# Altium schematic sheet Ad Hoc Radio Node 2005 v4.SCHDOC
size B
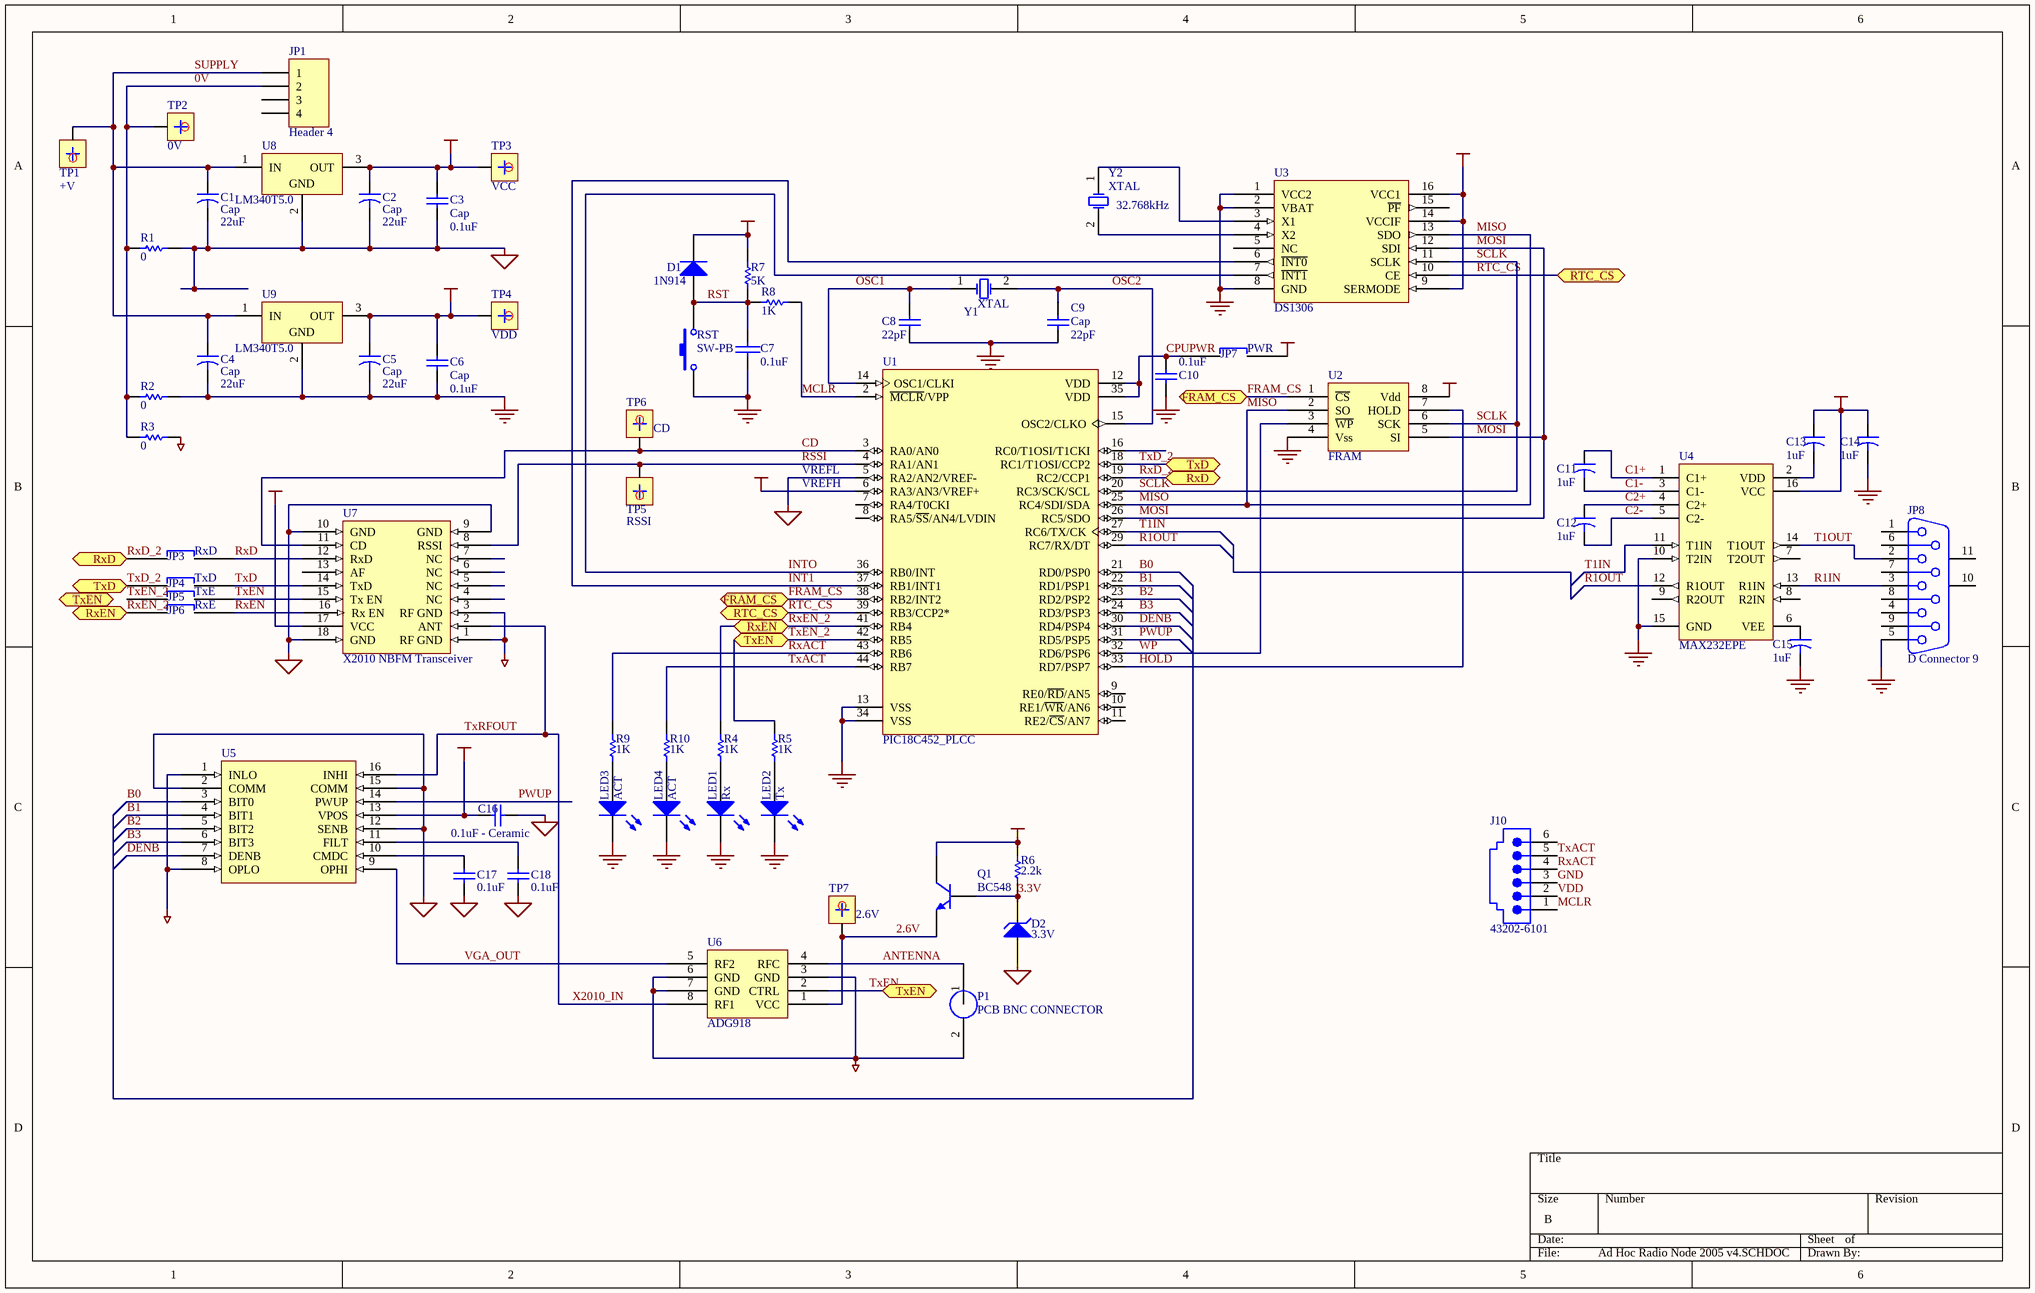
[diagram p0: Ad Hoc Radio Node 2005 v4.SCHDOC]

## Parts
C1  Cap  value 22uF  [0.1 ELECTRO CAP]
C2  Cap  value 22uF  [0.1 ELECTRO CAP]
C3  Cap  value 0.1uF  [0.1 CERAMIC CAP]
C4  Cap  value 22uF  [0.1 ELECTRO CAP]
C5  Cap  value 22uF  [0.1 ELECTRO CAP]
C6  Cap  value 0.1uF  [0.1 CERAMIC CAP]
C7  0.1uF  [0.1 ceramic cap]
C8  value 22pF  [0.1 CERAMIC CAP]  (hidden comment: Cap)
C9  Cap  value 22pF  [0.1 CERAMIC CAP]
C10  value 0.1uF  [0.1 CERAMIC CAP]
C11  value 1uF  [0.1 ELECTRO CAP]  (hidden comment: Cap2)
C12  value 1uF  [0.1 ELECTRO CAP]  (hidden comment: Cap2)
C13  value 1uF  [0.1 ELECTRO CAP]  (hidden comment: Cap2)
C14  value 1uF  [0.1 ELECTRO CAP]  (hidden comment: Cap2)
C15  value 1uF  [0.1 ELECTRO CAP]  (hidden comment: Cap2)
C16  value 0.1uF - Ceramic  [0.1 CERAMIC CAP]
C17  value 0.1uF  [0.1 CERAMIC CAP]
C18  value 0.1uF  [0.1 CERAMIC CAP]
D1  1N914  [diode-0.4/1.8]
D2  value 3.3V  [diode-0.4/1.8]  (hidden comment: D Zener)
J10  43202-6101  [JACK1.27-2H6]
JP1  Header 4  [4 Way Terminal Block]
JP3  RxD  [JUMPER]
JP4  TxD  [JUMPER]
JP5  TxE  [JUMPER]
JP6  RxE  [JUMPER]
JP7  PWR  [JUMPER]
JP8  D Connector 9  [DSUB1.385-2H9]
LED1  Rx  [Std LED]
LED2  Tx  [Std LED]
LED3  ACT  [Std LED]
LED4  ACT  [Std LED]
P1  PCB BNC CONNECTOR  [PCB BNC Connector]
Q1  BC548  [bjt]
R1  value 0  [AXIAL-0.3]
R2  value 0  [AXIAL-0.3]
R3  value 0  [AXIAL-0.3]
R4  value 1K  [AXIAL-0.4/1.8]
R5  value 1K  [AXIAL-0.4/1.8]
R6  value 2.2k  [AXIAL-0.4/1.8]
R7  value 5K  [AXIAL-0.4/1.8]  (hidden comment: Res1)
R8  value 1K  [AXIAL-0.4/1.8]  (hidden comment: Res1)
R9  value 1K  [AXIAL-0.4/1.8]
R10  value 1K  [AXIAL-0.4/1.8]
RST  SW-PB  [RESET SWITCH]
TP1  +V  [TESTPOINT]
TP2  0V  [TESTPOINT]
TP3  VCC  [TESTPOINT]
TP4  VDD  [TESTPOINT]
TP5  RSSI  [TESTPOINT]
TP6  CD  [TESTPOINT]
TP7  2.6V  [TESTPOINT]
U1  PIC18C452_PLCC  [PLCC 44-Way IC Socket]
U2  FRAM  [SOP-8]
U3  DS1306  [DIP-16]
U4  MAX232EPE  [DIP-16]
U5  (no value)  [ad8639 carrier board]
U6  ADG918  [DIP-8]
U7  X2010 NBFM Transceiver  [X2010]
U8  LM340T5.0  [SFM-T3/A4.7V]
U9  LM340T5.0  [SFM-T3/A4.7V]
Y1  XTAL  [XTAL]
Y2  XTAL  value 32.768kHz  [watch crystal]

## Ports
FRAM_CS, RTC_CS, RxD, RxEN, TxD, TxEN

## Nets
GND: C4.2 C5.2 C6.2 C7.2 C8.1 C9.1 C10.2 C14.2 C15.2 J10.3 JP8.5 LED1.2(K) LED2.2(K) LED3.2(K) LED4.2(K) R2.2 RST.1 U1.13(VSS) U1.34(VSS) U2.4(Vss) U3.1(VCC2) U3.2(VBAT) U3.8(GND) U4.10(T2IN) U4.15(GND) U9.2(GND)
RFGND: P1.2 R3.2 U5.1(INLO) U5.8(OPLO) U6.3(GND) U6.6(GND) U6.7(GND) U7.1(RF_GND) U7.3(RF_GND)
SGND: C1.2 C2.2 C3.2 C16.1 C17.2 C18.2 D2.1(A) R1.2 U1.5(RA2/AN2/VREF-) U5.2(COMM) U5.12(SENB) U5.15(COMM) U7.9(GND) U7.10(GND) U7.18(GND) U8.2(GND)
VCC: C2.1 C3.1 C16.2 Q1.1(C) R6.1 TP3.1(TP) U1.6(RA3/AN3/VREF+) U5.13(VPOS) U7.17(VCC) U8.3(OUT)
VDD: C5.1 C6.1 C13.1 C14.1 D1.2(K) J10.2 JP7.2 R7.2 TP4.1(TP) U2.8(Vdd) U3.9(SERMODE) U3.14(VCCIF) U3.16(VCC1) U4.16(VCC) U9.3(OUT)
0V: JP1.2 R1.1 R2.1 R3.1 TP2.1(TP)
2.6V: Q1.3(E) TP7.1(TP) U6.1(VCC)
3.3V: D2.2(K) Q1.2(B) R6.2
ANTENNA: P1.1 U6.4(RFC)
B0: U1.21(RD0/PSP0) U5.3(BIT0)
B1: U1.22(RD1/PSP1) U5.4(BIT1)
B2: U1.23(RD2/PSP2) U5.5(BIT2)
B3: U1.24(RD3/PSP3) U5.6(BIT3)
C1+: C11.1 U4.1(C1+)
C1-: C11.2 U4.3(C1-)
C2+: C12.1 U4.4(C2+)
C2-: C12.2 U4.5(C2-)
CD: TP6.1(TP) U1.3(RA0/AN0) U7.11(CD)
CPUPWR: C10.1 JP7.1 U1.12(VDD) U1.35(VDD)
DENB: U1.30(RD4/PSP4) U5.7(DENB)
FRAM_CS: U1.38(RB2/INT2) U2.1(~{CS}) ; port FRAM_CS
HOLD: U1.33(RD7/PSP7) U2.7(HOLD)
INT1: U1.37(RB1/INT1) U3.6(~{INT0})
INTO: U1.36(RB0/INT) U3.7(~{INT1})
MCLR: J10.1 R8.1 U1.2(~{MCLR}/VPP)
MISO: U1.25(RC4/SDI/SDA) U2.2(SO) U3.13(SDO)
MOSI: U1.26(RC5/SDO) U2.5(SI) U3.12(SDI)
OSC1: C8.2 U1.14(OSC1/CLKI) Y1.1(OSC1)
OSC2: C9.2 U1.15(OSC2/CLKO) Y1.2(OSC2)
PWUP: U1.31(RD5/PSP5) U5.14(PWUP)
R1IN: JP8.3 U4.13(R1IN)
R1OUT: U1.29(RC7/RX/DT) U4.12(R1OUT)
RSSI: TP5.1(TP) U1.4(RA1/AN1) U7.8(RSSI)
RST: C7.1 D1.1(A) R7.1 R8.2 RST.2
RTC_CS: U1.39(RB3/CCP2*) U3.10(CE) ; port RTC_CS
RxACT: J10.4 R9.1 U1.43(RB6)
RxD: JP3.2 U7.12(RxD)
RxD_2: JP3.1 U1.19(RC2/CCP1) ; port RxD
RxEN: JP6.2 U7.16(Rx_EN)
RxEN_2: JP6.1 R4.1 U1.41(RB4) ; port RxEN
SCLK: U1.20(RC3/SCK/SCL) U2.6(SCK) U3.11(SCLK)
SUPPLY: C1.1 C4.1 JP1.1 TP1.1(TP) U8.1(IN) U9.1(IN)
T1IN: U1.27(RC6/TX/CK) U4.11(T1IN)
T1OUT: JP8.2 U4.14(T1OUT)
TxACT: J10.5 R10.1 U1.44(RB7)
TxD: JP4.2 U7.14(TxD)
TxD_2: JP4.1 U1.18(RC1/T1OSI/CCP2) ; port TxD
TxEN: JP5.1 JP5.2 R5.1 U1.42(RB5) U6.2(CTRL) U7.15(Tx_EN) ; port TxEN  [also labelled TxEN_2]
TxRFOUT: U5.16(INHI) U6.8(RF1) U7.2(ANT)  [also labelled X2010_IN]
VGA_OUT: U5.9(OPHI) U6.5(RF2)
WP: U1.32(RD6/PSP6) U2.3(~{WP})
NetC13_2: C13.2 U4.2(VDD)
NetC15_1: C15.1 U4.6(VEE)
NetC17_1: C17.1 U5.10(CMDC)
NetC18_1: C18.1 U5.11(FILT)
NetLED1_1: LED1.1(A) R4.2
NetLED2_1: LED2.1(A) R5.2
NetLED3_1: LED3.1(A) R9.2
NetLED4_1: LED4.1(A) R10.2
NetU3_3: U3.3(X1) Y2.1(OSC1)
NetU3_4: U3.4(X2) Y2.2(OSC2)

Not connected (* = marked no-connect by the designer): J10 6; JP1 3 4; JP8 1 4 6 7 8 9 10(MH1) 11(MH2); U1 7(RA4/T0CKI) 8(RA5/~{SS}/AN4/LVDIN) 9(RE0/~{RD}/AN5) 10(RE1/~{WR}/AN6) 11(RE2/~{CS}/AN7) 16(RC0/T1OSI/T1CKI); U3 5(NC) 15(~{PF}); U4 7(T2OUT) 8(R2IN) 9(R2OUT); U7 4(NC) 5(NC) 6(NC) 7(NC) 13(AF)

## Notes on the sheet
- (near U1) VREFL
- (near U1) VREFH

## Library data of the parts
C1 C2 C4 C5 C11-C15 = Cap2: Capacitor; Manufacturer: Generic Components; Class I: Passive; Published: 23-Sep-2002; Publisher: Altium Limited; Class II: Capacitor
C3 C6 C8-C10 C16-C18 = Cap: Capacitor; Manufacturer: Generic Components; Class I: Passive; Published: 8-Jun-2000; Revision: July-2002: Re-released for DXP Platform.; Publisher: Altium Limited; Class II: Capacitor
C7 = CAP: Capacitor
D1 = Diode: Default Diode; Manufacturer: Generic Components; Class I: Discrete; Class II: Diode - Switching; Published: 8-Jun-2000; Revision: July-2002: Re-released for DXP Platform.; Publisher: Altium Limited
D2 = D Zener: Zener Diode; Manufacturer: Generic Components; Class I: Discrete; Class II: Diode - Zener; Published: 8-Jun-2000; Revision: July-2002: Re-released for DXP Platform.; Publisher: Altium Limited
J10 = 43202-6101: Right Angle, Ultra Low Profile PCB Jack, Unshielded Version; Manufacturer: Molex; Package Information: Latest Revision: 10-Apr-2001; Class I: Connector; Class II: Modular Jacks; Ports: 1; Positions/Loaded: Port1: 6/6; PCB Mounting: THT; Drill Diameter: Nominal, Rounded to nearest 0.05mm; PCB Layout: Complies with Manufacturer's Recommendation.; Published: 25-Jun-2002; Datasheet: Latest Revision: 18-Dec-2001; Package Reference: 43202; Publisher: Altium Limited; Category: 3/4
JP1 = Header 4: Header, 4-Pin; Manufacturer: Generic Components; Class I: Connector; Revision: July-2002: Re-released for DXP Platform.; Publisher: Altium Limited
JP3-JP7 = JUMPER
JP8 = D Connector 9: Receptacle Assembly, 9 Position, Right Angle; Manufacturer: Generic Components; Package Information: Latest Revision: O; Positions: 9; Published: 15-Jun-2001; Revision: July-2002: Re-released for DXP Platform.; Datasheet: (1-Sep-1999); Package Reference: 788750; Publisher: Altium Limited; Class I: Connector; Orientation: Right Angle; Gender: Receptacle
LED1-LED4 = LED2: Typical RED, GREEN, YELLOW, AMBER GaAs LED; Manufacturer: Generic Components; Class I: Optoelectronic; Published: 8-Jun-2000; Revision: July-2002: Re-released for DXP Platform.; Publisher: Altium Limited; Class II: LED
Q1 = NPN: NPN Bipolar Transistor; Manufacturer: Generic Components; Class I: Discrete; Class II: BJT - Low Power; Published: 8-Jun-2000; Revision: July-2002: Re-released for DXP Platform.; Publisher: Altium Limited
R1-R10 = Res1: Resistor; Manufacturer: Generic Components; Class I: Passive; Published: 8-Jun-2000; Revision: July-2002: Re-released for DXP Platform.; Publisher: Altium Limited; Class II: Resistor
RST = SW-PB: Switch; Manufacturer: Generic Components; Published: 24-Mar-1999; Revision: July-2002: Re-released for DXP Platform.; Publisher: Altium Limited
TP1-TP7 = TESTPOINT: Test Point
U4 = MAX232EPE: +5V Powered RS-232 Driver/Receiver; Manufacturer: Maxim; Class I: Communication; Class II: Transceiver; Published: 16-Jan-2001; Revision: July-2002: Re-released for DXP Platform.; Datasheet: Latest Revision: Apr-1992; Package Reference: PE16A; Publisher: Altium Limited
U5 = AD8369_DIGITAL_CONT_PWR_AMP
U7 = NBFM_TRANSCEIVER
U8 U9 = LM340T5.0: Series 3-Terminal Positive Regulator; Manufacturer: National Semiconductor; Package Information: Latest Revision: 1995; Class I: Power Management; Class II: Voltage Regulator; Note: Tab is connected to GND; Published: 15-Apr-2002; Datasheet: Latest Revision: Jan-1995; Package Reference: T03B; Publisher: Altium Limited
Y1 Y2 = XTAL: Crystal Oscillator; Manufacturer: Generic Components; Published: 8-Jun-2000; Revision: July-2002: Re-released for DXP Platform.; Publisher: Altium Limited; Class I: Oscillator; Class II: Crystal Oscillator